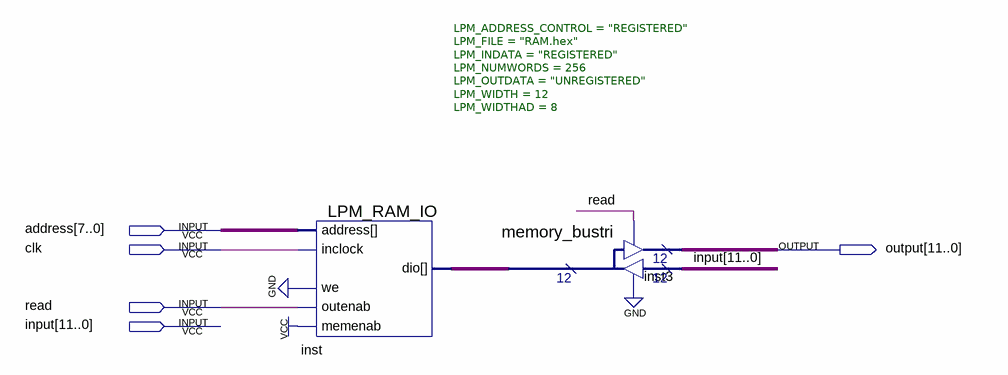
[diagram p0: schematic sheet]
// Quartus schematic Memory.bdf as structural Verilog: 2 symbols, 5 pins
module Memory (
  input  [7:0] address,
  input  clk,
  input  read,
  input  [11:0] \input ,
  output [11:0] \output 
);

  wire [11:0] inst_dio;

  LPM_RAM_IO #(.LPM_ADDRESS_CONTROL("REGISTERED"), .LPM_FILE("RAM.hex"), .LPM_INDATA("REGISTERED"), .LPM_NUMWORDS(256), .LPM_OUTDATA("UNREGISTERED"), .LPM_WIDTH(12), .LPM_WIDTHAD(8)) inst (
    .address(address), .memenab(1'b1), .inclock(clk), .we(1'b0), .outenab(read), .dio(inst_dio));
  memory_bustri inst3 (.enabledt(1'b0), .data(\input ), .enabletr(read), .result(\output ), .tridata(inst_dio));
endmodule
